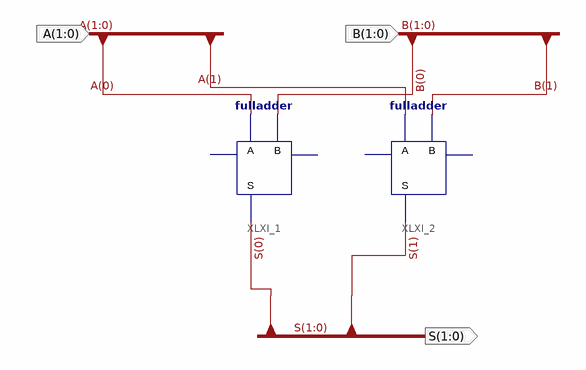
[diagram p0: schematic sheet 1]
// Xilinx ISE schematic fulladder2bit.sch (spartan3e) as structural Verilog: 2 symbols, 3 ports
module fulladder2bit (
  input  [1:0] A,
  input  [1:0] B,
  output [1:0] S
);

  fulladder XLXI_1 (.A(A[0]), .B(B[0]), .S(S[0]));  // open: cin, cout
  fulladder XLXI_2 (.A(A[1]), .B(B[1]), .S(S[1]));  // open: cin, cout
endmodule
